# EAGLE design LT1301_1r (EAGLE 9.1.0)
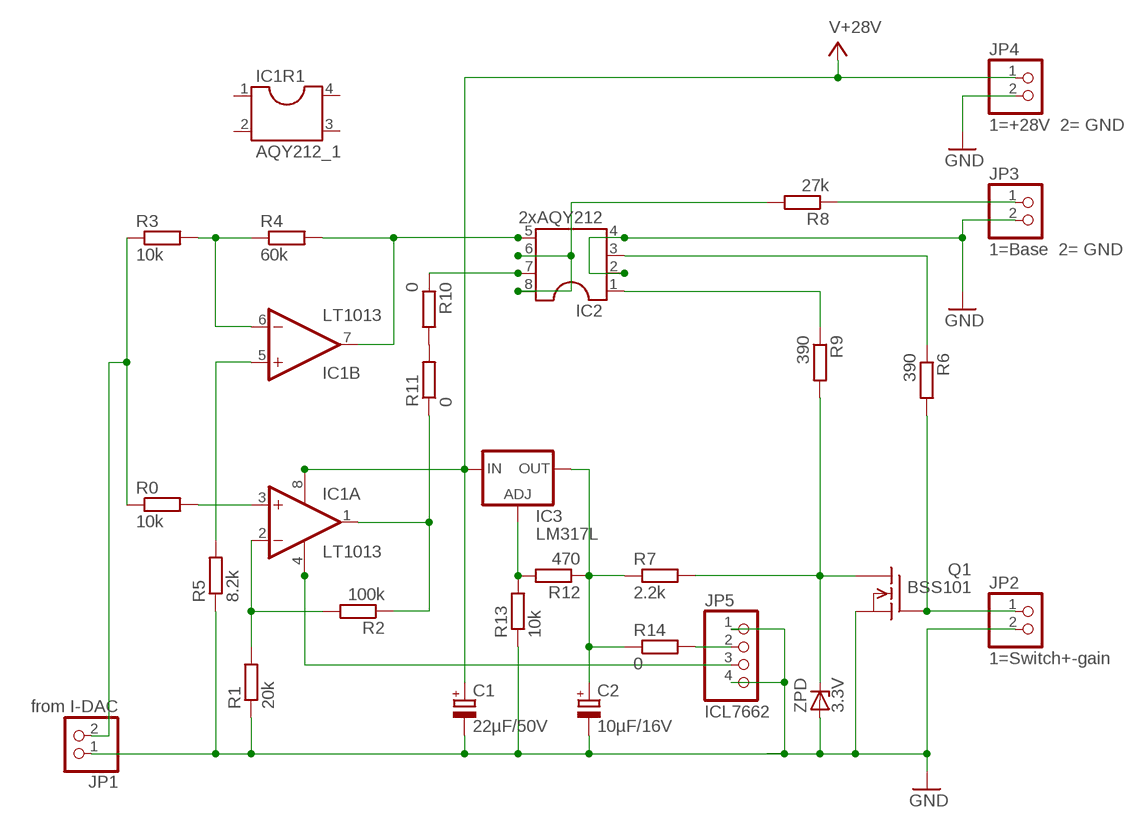
[diagram p0: schematic, sheet 1]

## Parts
C1  22µF/50V  CPOL-EUE5-10.5  [E5-10,5]
C2  10µF/16V  CPOL-EUB45181B  [B45181B]
IC1  LT1013  LF412N  [DIL08]
IC1R1  AQY212_1  DIL4S  [SOCKET-04]
IC2  2xAQY212  DIL8S  [SOCKET-08]
IC3  LM317L  [317L]
JP1  from I-DAC  PINHD-1X2  [1X02]
JP2  1=Switch+-gain  PINHD-1X2  [1X02]
JP3  1=Base 2= GND  PINHD-1X2  [1X02]
JP4  1=+28V 2= GND  PINHD-1X2  [1X02]
JP5  ICL7662  PINHD-1X4  [1X04]
Q1  BSS101  [TO92]
R0  10k  R-EU_0207/7  [0207/7]
R1  20k  R-EU_0207/7  [0207/7]
R2  100k  R-EU_0207/7  [0207/7]
R3  10k  R-EU_0207/7  [0207/7]
R4  60k  R-EU_0207/7  [0207/7]
R5  8.2k  R-EU_0207/7  [0207/7]
R6  390  R-EU_0207/7  [0207/7]
R7  2.2k  R-EU_0207/7  [0207/7]
R8  27k  R-EU_0207/7  [0207/7]
R9  390  R-EU_0207/7  [0207/7]
R10  0  R-EU_0207/7  [0207/7]
R11  0  R-EU_0207/7  [0207/7]
R12  470  R-EU_0207/7  [0207/7]
R13  10k  R-EU_0207/7  [0207/7]
R14  0  R-EU_0207/7  [0207/7]
ZPD  3.3V  ZENER-DIODEZD-7.5  [ZDIO-7.5]

## Nets
GND: C1.- C2.- IC2.2 IC2.4 JP1.1 JP2.2 JP3.2 JP4.2 JP5.1 JP5.4 Q1.1(S) R1.1 R5.1 R13.1 ZPD.A
N$1: IC1.6(B:-IN) R3.2 R4.1
N$2: IC1.2(A:-IN) R1.2 R2.2
N$3: IC1.1(A:OUT) R2.1 R11.1
N$4: IC1.3(A:+IN) R0.2
N$5: IC2.1 R9.1
N$6: IC1.7(B:OUT) IC2.5 R4.2
N$7: Q1.3(D) R7.2 R9.2 ZPD.C
N$8: JP5.2 R14.2
N$9: JP3.1 R8.1
N$10: IC2.6 IC2.8 R8.2
N$11: JP2.1 Q1.2(G) R6.2
N$12: JP1.2 R0.1 R3.1
N$13: IC1.5(B:+IN) R5.2
N$14: IC2.3 R6.1
N$15: IC2.7 R10.1
N$16: R10.2 R11.2
N$18: IC1.4(P:V-) JP5.3
N$19: IC3.1(ADJ) R12.2 R13.2
N$20: C2.+ IC3.2(OUT) R7.1 R12.1 R14.1
V+: C1.+ IC1.8(P:V+) IC3.3(IN) JP4.1 ; supply symbol labelled V+28V
Unconnected: IC1R1.1 IC1R1.2 IC1R1.3 IC1R1.4

## Library data of the parts
C1 = rcl:CPOL-EU: POLARIZED CAPACITOR, European symbol; SPICEPREFIX: C
C2 = resistor:CPOL-EU: POLARIZED CAPACITOR, European symbol
IC1 = linear:LF412: OP AMP
IC1R1 = ic-package:DIL4: Dual In Line / Socket
IC2 = ic-package:DIL8: Dual In Line / Socket
IC3 = v-reg:LM317L: VOLTAGE REGULATOR
JP1-JP4 = pinhead:PINHD-1X2: PIN HEADER
JP5 = pinhead:PINHD-1X4: PIN HEADER
Q1 = transistor-fet:BSS101: N-Channel Enhancement MOSFET 200V; 0,16A; 11Ohm
R0 R1-R14 = rcl:R-EU_: RESISTOR, European symbol; SPICEPREFIX: R
ZPD = diode:ZENER-DIODE: Z-Diode

## Board
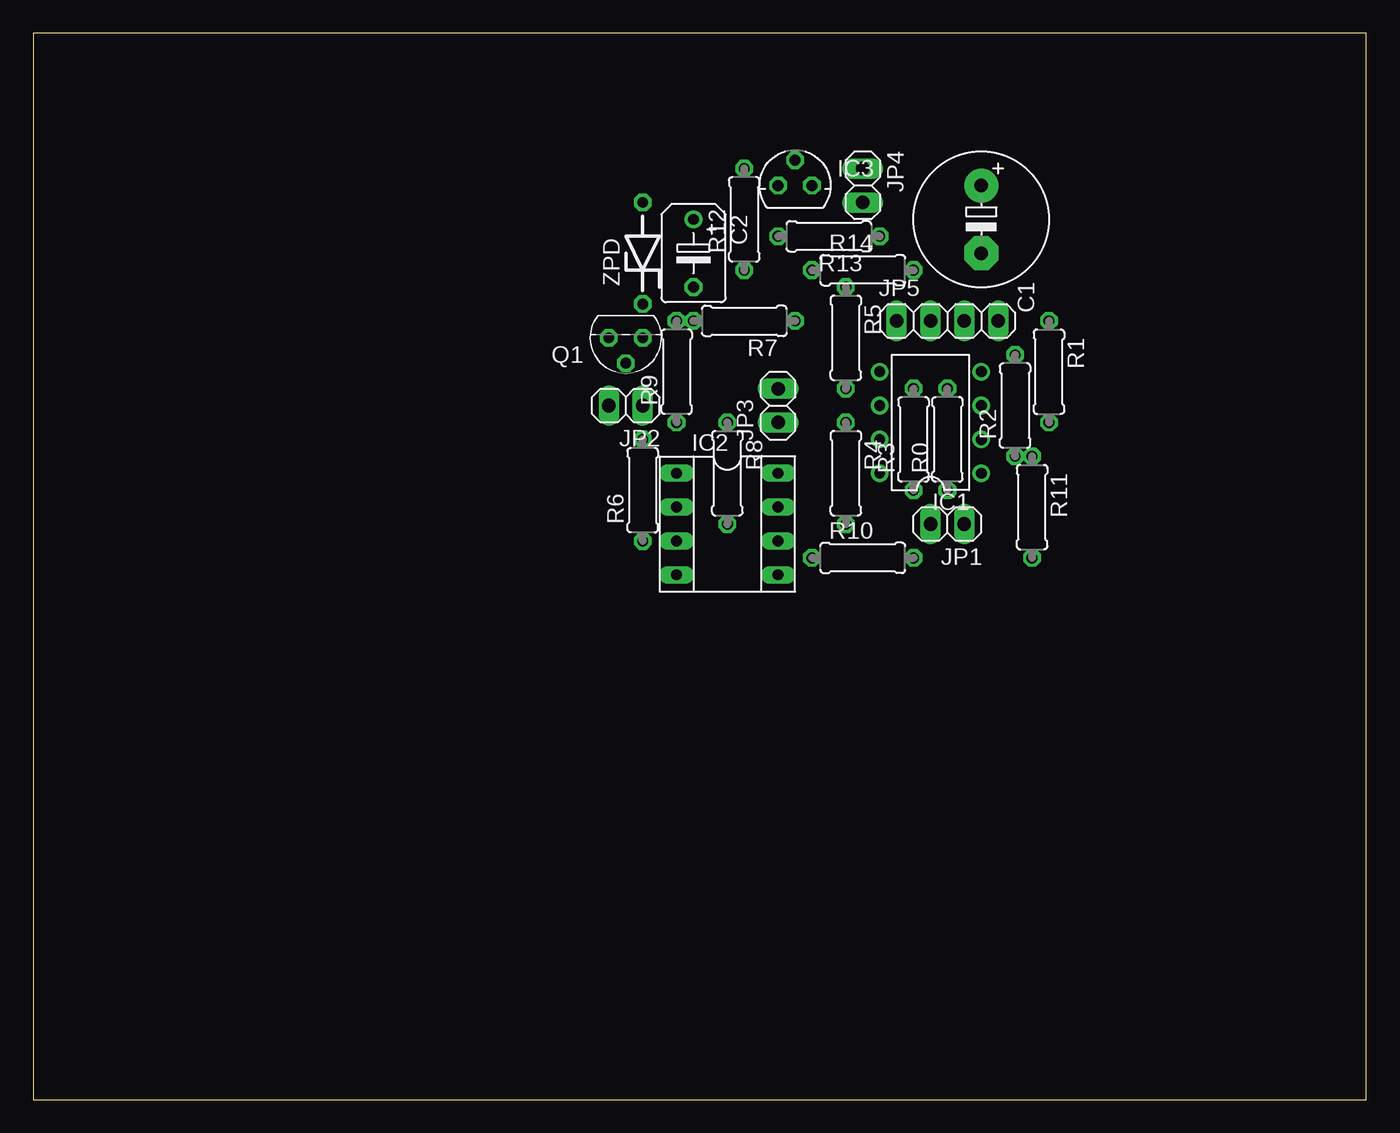
[diagram p1: board, top side]
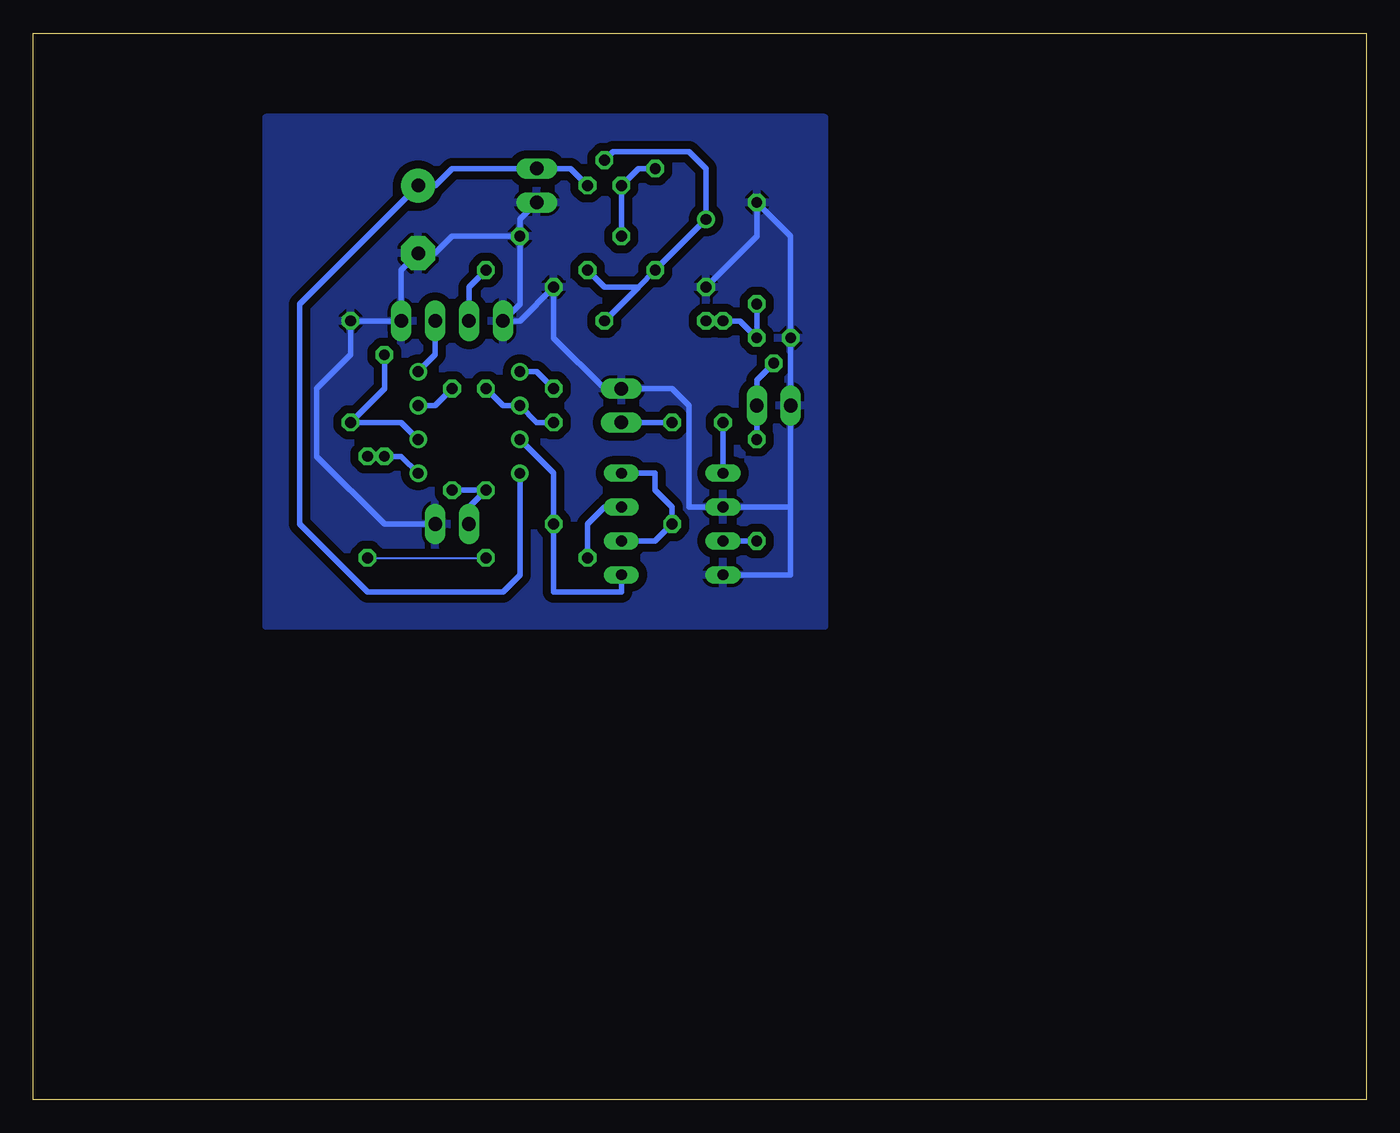
[diagram p2: board, bottom side, seen from below]

Size 100 x 80 mm. Coordinates in mm from the lower left corner, seen from the top.
Outline: 0,0 100,0 100,80 0,80 0,0
Copper layers (1*16): Top 0.035mm / dielectric 1.5mm / Bottom 0.035mm
Design rules "default": minimum track width 6mil, minimum drill 0.35mm, track to track 6mil, track to pad 6mil, pad to pad 6mil, via to via 6mil, smd to smd 6mil, copper to edge 40mil, drill to drill 6mil, minimum pad ring 10mil, minimum via ring 8mil, stop-mask expansion 4mil, vias tented up to drill 0mil, thermal gap 10mil

### Footprints (pad centres in the part's own frame; a part is rotated, then mirrored left to right if it is on the bottom)
E5-10,5 = drill 1.016 pad 2.54: + -2.54,0 | drill 1.016 pad 2.54 octagon: - 2.54,0
B45181B = drill 0.813: + -2.54,0 | drill 0.813 octagon: - 2.54,0
DIL08 = drill 0.813 pad 1.27: 1 -3.81,-3.81; 2 -1.27,-3.81; 3 1.27,-3.81; 4 3.81,-3.81; 5 3.81,3.81; 6 1.27,3.81; 7 -1.27,3.81; 8 -3.81,3.81
SOCKET-04 = drill 0.813 long: 1 -1.27,-3.81; 2 1.27,-3.81; 3 1.27,3.81; 4 -1.27,3.81
SOCKET-08 = drill 0.813 long: 1 -3.81,-3.81; 2 -1.27,-3.81; 3 1.27,-3.81; 4 3.81,-3.81; 5 3.81,3.81; 6 1.27,3.81; 7 -1.27,3.81; 8 -3.81,3.81
317L = drill 0.813 octagon: 1 -1.27,0; 2 0,1.905; 3 1.27,0
1X02 = drill 1.016 long: 1 -1.27,0; 2 1.27,0
1X04 = drill 1.016 long: 1 -3.81,0; 2 -1.27,0; 3 1.27,0; 4 3.81,0
TO92 = drill 0.813 octagon: 1 1.27,0; 2 0,1.905; 3 -1.27,0
0207/7 = drill 0.813 octagon: 1 -3.81,0; 2 3.81,0
ZDIO-7.5 = drill 0.813 octagon: A 3.81,0; C -3.81,0

### Placement (x,y rotation side)
C1  71.12,66.04 270 top
C2  49.53,63.5 270 top
IC1  67.31,50.8 90 top
IC1R1  -17.78,6.35 0 top  (outside the outline)
IC2  52.07,43.18 270 top
IC3  57.15,68.58 0 top
JP1  68.58,43.18 180 top
JP2  44.45,52.07 180 top
JP3  55.88,52.07 90 top
JP4  62.23,68.58 270 top
JP5  68.58,58.42 0 top
Q1  44.45,57.15 180 top
R0  68.58,49.53 90 top
R1  76.2,54.61 270 top
R2  73.66,52.07 90 top
R3  66.04,49.53 90 top
R4  60.96,46.99 270 top
R5  60.96,57.15 270 top
R6  45.72,45.72 90 top
R7  53.34,58.42 180 top
R8  52.07,46.99 270 top
R9  48.26,54.61 90 top
R10  62.23,40.64 0 top
R11  74.93,44.45 270 top
R12  53.34,66.04 90 top
R13  59.69,64.77 180 top
R14  62.23,62.23 0 top
ZPD  45.72,63.5 90 top

### Tracks (layer width: path | path; a pad name or v marks a point on that pad's centre or on a via)
GND
  Bottom 0.406: 43.18,44.45 JP2.2 Q1.1 43.18,64.77 ZPD.A 45.72,64.77 C2.- | 43.18,44.45 IC2.2 50.8,44.45 50.8,52.07 52.07,53.34 JP3.2 57.15,53.34 60.96,57.15 R5.1 63.5,58.42 JP5.1 63.5,59.69 R13.1 | IC2.4 43.18,39.37 43.18,44.45 | JP4.2 63.5,66.04 R13.1 | R13.1 68.58,64.77 69.85,63.5 C1.- 72.39,62.23 JP5.4 R1.1 76.2,55.88 78.74,53.34 78.74,48.26 73.66,43.18 JP1.1
  pour Bottom (isolate 0.61): 82.55,73.66 82.55,35.56 40.64,35.56 40.64,73.66
N$1
  Bottom 0.406: R3.2 64.77,52.07 IC1.6 62.23,50.8 R4.1
N$2
  Bottom 0.406: R2.2 73.66,53.34 R1.2 72.39,50.8 IC1.2
N$3
  Bottom 0.406: R2.1 R11.1 72.39,48.26 IC1.1
N$4
  Bottom 0.406: R0.2 69.85,52.07 IC1.3
N$5
  Bottom 0.406: R9.1 IC2.1
N$6
  Bottom 0.406: IC1.7 60.96,46.99 R4.2 60.96,40.64 60.96,38.1 55.88,38.1 IC2.5
N$7
  Bottom 0.406: ZPD.C Q1.3 46.99,58.42 R9.2 R7.2
N$8
  Bottom 0.406: JP5.2 67.31,60.96 R14.2
N$9
  Bottom 0.406: JP3.1 R8.1
N$10
  Bottom 0.406: IC2.6 53.34,41.91 R8.2 52.07,44.45 53.34,45.72 53.34,46.99 IC2.8
N$11
  Bottom 0.406: R6.2 JP2.1 45.72,53.98 Q1.2
N$12
  Bottom 0.406: JP1.2 67.31,44.45 R3.1 R0.1
N$13
  Bottom 0.406: R5.2 62.23,54.61 IC1.5
N$14
  Bottom 0.406: R6.1 IC2.3
N$15
  Bottom 0.406: IC2.7 57.15,44.45 58.42,43.18 R10.1
N$16
  Bottom 0.152: R11.2 R10.2
N$18
  Bottom 0.406: JP5.3 69.85,55.88 IC1.4
N$19
  Bottom 0.406: R13.2 IC3.1 54.61,69.85 R12.2
N$20
  Bottom 0.406: IC3.2 56.52,71.12 50.8,71.12 49.53,69.85 C2.+ R12.1 54.61,60.96 | 54.61,60.96 R7.1 | R14.1 57.15,60.96 54.61,60.96
V+
  Bottom 0.406: IC3.3 59.69,69.85 JP4.1 68.58,69.85 69.85,68.58 C1.+ 80.01,59.69 80.01,43.18 74.93,38.1 64.77,38.1 63.5,39.37 IC1.8